# EAGLE design TIEVOX Power (EAGLE 7.4.0)
Power Notes For IC_PWR_1 to work the way we want it to, meaning supplying power from the car, a value of 2.2K - 6K will work just fine for R1. That gives a turn on voltage of 5.5VDC to ~10VDC. Backpower Protection All power inputs are poly fused and have a backpower diode circuit for protecting the RPi.
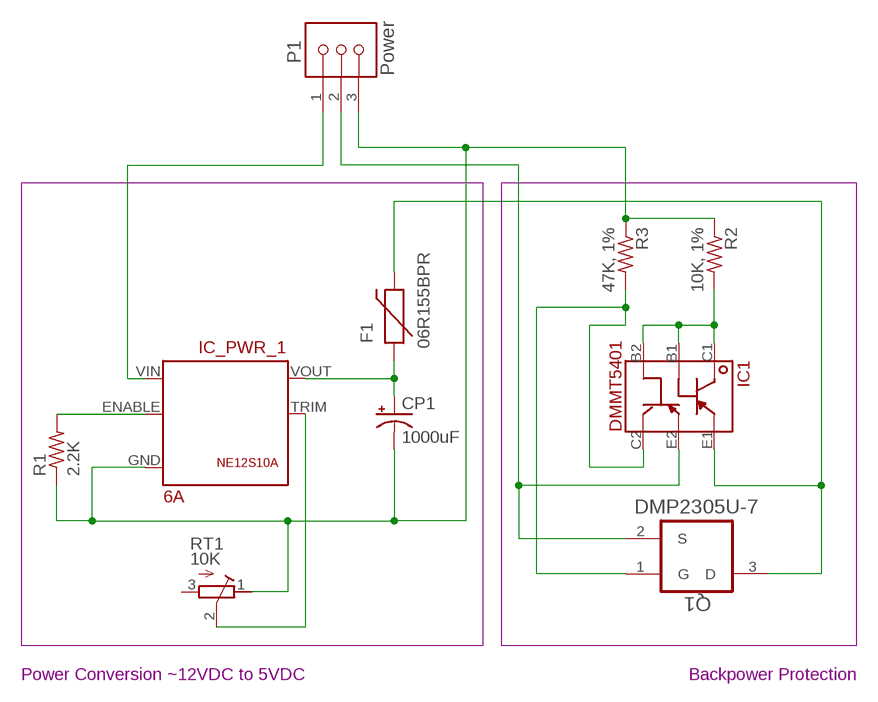
[diagram p0: schematic, sheet 1]

## Parts
CP1  1000uF  CPOL-USE3.5-8  [E3,5-8]
F1  06R155BPR  PTCPTH  [PTC]
IC1  DMMT5401  DMMT5401DMMT  [DMMT5401]
IC_PWR_1  6A  NE12S12V6A  [NE12S]
P1  Power  CONN3-L  [PINHEAD-LOCK-3]
Q1  DMP2305U-7  [SOT103P240X110-3N]
R1  2.2K  R-US_0207/10  [0207/10]
R2  10K, 1%  R-US_0207/7  [0207/7]
R3  47K, 1%  R-US_0207/7  [0207/7]
RT1  10K  R-TRIMM3006P  [RTRIM3006P]

## Nets
+5VDC: IC1.E2 P1.2 Q1.2(S)
GND: IC1.C2 Q1.1(G) R3.2
GND_PC: CP1.- IC_PWR_1.GND P1.3 R1.1 R2.1 R3.1 RT1.1(E)
IN: F1.P$2 IC1.E1 Q1.3(D)
N$16: IC_PWR_1.VIN P1.1
N$28: CP1.+ F1.P$1 IC_PWR_1.VOUT
N$29: IC_PWR_1.ENABLE R1.2
N$32: IC1.B1 IC1.B2 IC1.C1 R2.2
PWR12_TRIM: IC_PWR_1.TRIM RT1.2(S)
Unconnected: RT1.3(A)

## Notes on the sheet
- Power Conversion ~12VDC to 5VDC | Backpower Protection

## Library data of the parts
CP1 = rcl:CPOL-US: POLARIZED CAPACITOR, American symbol
F1 = SparkFun-PowerIC:PTC: Resettable Fuse PTC Resettable Fuse. Spark Fun Electronics SKU : COM-08357
IC1 = Diodes_Inc_By_element14_Batch_1:DMMT5401
IC_PWR_1 = packages:NE12S*
P1 = connector:CONN3-L: 3 pin connector, unspecified; DESC: Header, 3 pin locking; MANUF: Molex; PARTNUM: 22-23-2031; SUPPLIER: Mouser:538-22-23-2031; VALSTAT: label
Q1 = Diodes_Inc_By_element14_Batch_1:DMP2305U-7: P-CHANNEL ENHANCEMENT MODE MOSFET; MPN: DMP2305U-7; OC_FARNELL: 1858668; OC_NEWARK: 23T5607; PACKAGE: SOT-23-3; SUPPLIER: DIODES INC.
R1-R3 = adafruit:R-US_: RESISTOR, American symbol
RT1 = resistor:R-TRIMM: Trimm resistor

## Board
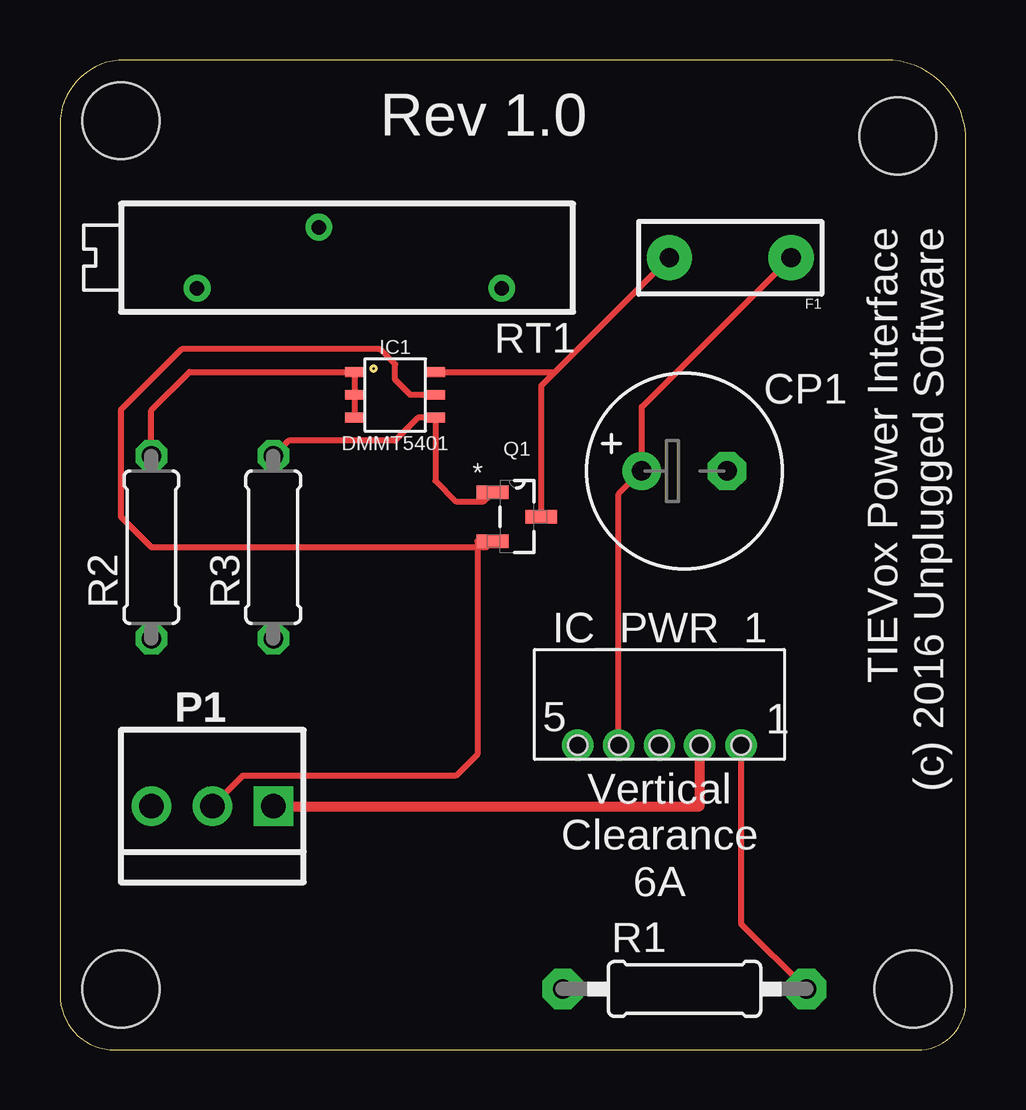
[diagram p1: board, top side]
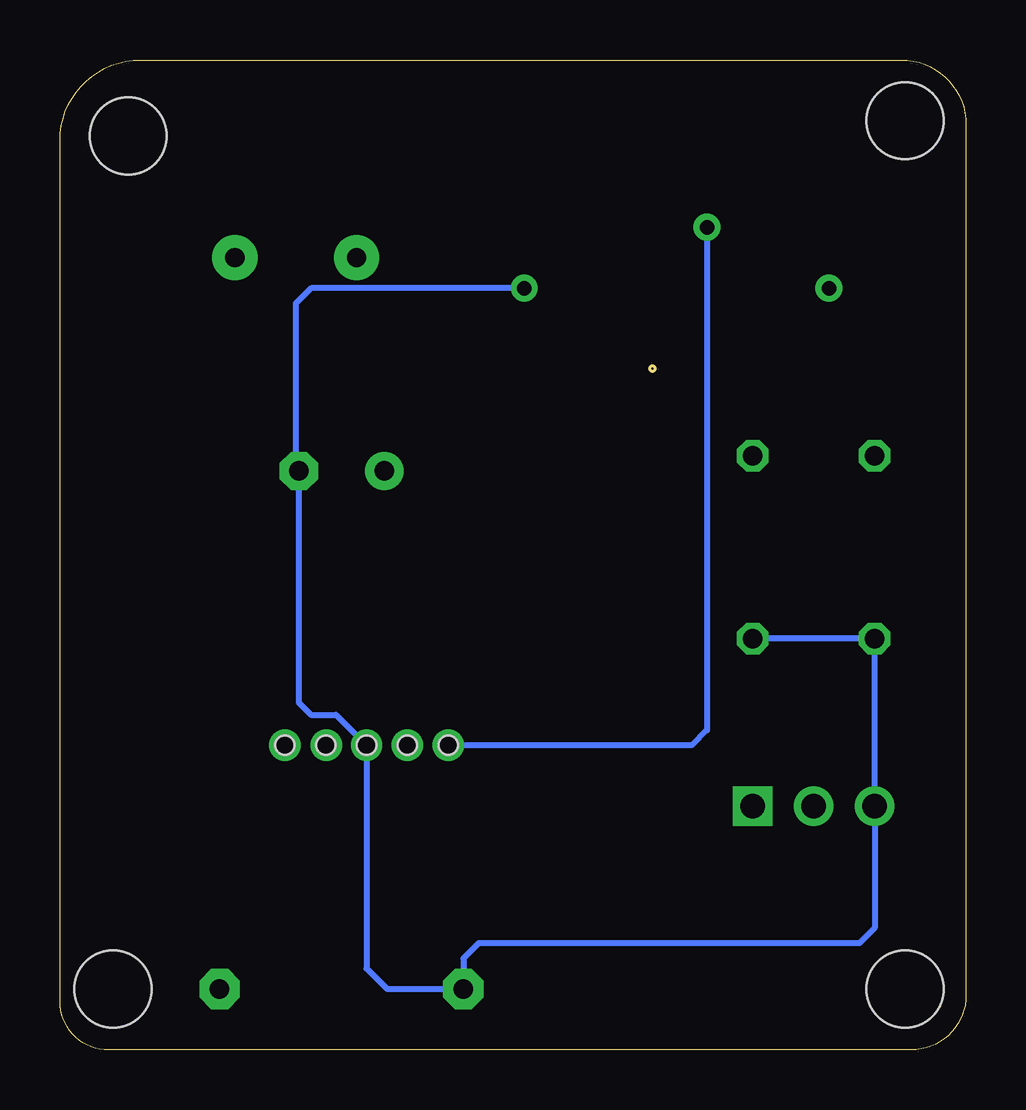
[diagram p2: board, bottom side, seen from below]

Size 37.77 x 41.27 mm. Coordinates in mm from the lower left corner, seen from the top.
Outline: 0,38.58 0,2.29 arc90 2.29,0 35.75,0 arc90 37.77,2.02 37.77,37.91 arc90 34.41,41.27 2.69,41.27 arc90 0,38.58
Copper layers (1*16): Top 0.035mm / dielectric 1.5mm / Bottom 0.035mm
Design rules "default": minimum track width 10mil, minimum drill 24mil, track to track 8mil, track to pad 8mil, pad to pad 8mil, via to via 8mil, smd to smd 8mil, copper to edge 40mil, drill to drill 8mil, minimum pad ring 10mil, minimum via ring 8mil, stop-mask expansion 4mil, vias tented up to drill 0mil, thermal gap 10mil
Holes 3.2 mm at 2.54,2.54 2.54,38.73 34.92,38.1 35.56,2.54

### Footprints (pad centres in the part's own frame; a part is rotated, then mirrored left to right if it is on the bottom)
E3,5-8 = drill 0.813 pad 1.6: + -1.778,0 | drill 0.813 pad 1.6 octagon: - 1.778,0
PTC = drill 0.8 pad 1.88: P$1 -2.54,0; P$2 2.54,0
DMMT5401 = smd 0.406 x 0.813: B1 0,-1.676; B2 0.95,-1.676; C1 -0.95,-1.676; C2 0.95,1.676; E1 -0.95,1.676; E2 0,1.676
NE12S = drill 0.8: ENABLE 6.8,0; GND 3.4,0; TRIM 0,0; VIN 5.08,0; VOUT 1.7,0 | hole 0.8: 1.7,0; 3.4,0; 5.1,0; 6.8,0; 0,0
PINHEAD-LOCK-3 = drill 1.016 pad 1.651 square: 1 2.54,0 | drill 1.016 pad 1.651: 2 0,0; 3 -2.54,0
SOT103P240X110-3N = smd 1.321 x 0.559: 1 -1.016,1.016; 2 -1.016,-1.016; 3 1.016,0
0207/10 = drill 0.813 pad 1.676 octagon: 1 -5.08,0; 2 5.08,0
0207/7 = drill 0.813 octagon: 1 -3.81,0; 2 3.81,0
RTRIM3006P = drill 0.61: 1 -7.62,1.27; 2 0,-1.27; 3 5.08,1.27

### Placement (x,y rotation side)
CP1  26.04,24.13 0 top
F1  27.94,33.02 180 top
IC1  13.97,27.3 270 top
IC_PWR_1  21.59,12.7 0 top
P1  6.35,10.16 0 top
Q1  19.05,22.23 0 top
R1  26.04,2.54 0 top
R2  3.81,20.95 90 top
R3  8.89,20.95 90 top
RT1  10.79,33.02 180 top

### Tracks (layer width: path | path; a pad name or v marks a point on that pad's centre or on a via)
+5VDC
  Top 0.254: IC1.E2 14.61,27.3 13.97,27.94 13.97,28.57 13.34,29.21 5.08,29.21 2.54,26.67 2.54,22.23 3.81,20.95 17.78,20.95 Q1.2 17.4,21.21 17.4,12.32 16.51,11.43 7.62,11.43 P1.2
GND
  Top 0.254: Q1.1 17.65,22.86 16.51,22.86 15.65,23.72 IC1.C2 14.93,26.36 13.97,25.4 9.53,25.4 R3.2
GND_PC
  Bottom 0.254: RT1.1 27.3,31.75 27.94,31.11 27.94,24.26 CP1.- 27.81,14.48 27.3,13.97 26.26,13.97 IC_PWR_1.GND 24.99,3.4 24.13,2.54 R1.1 20.95,3.81 20.32,4.45 4.45,4.45 3.81,5.08 P1.3 R2.1 R3.1
IN
  Top 0.254: IC1.E1 20.64,28.25 | 20.64,28.25 F1.P$2 | Q1.3 20.07,27.69 20.64,28.25
N$16
  Top 0.406: P1.1 26.67,10.16 IC_PWR_1.VIN
N$28
  Top 0.254: IC_PWR_1.VOUT 23.29,23.16 CP1.+ 24.26,26.8 F1.P$1
N$29
  Top 0.254: IC_PWR_1.ENABLE 28.39,5.26 R1.2
N$32
  Top 0.254: IC1.B2 IC1.B1 IC1.C1 5.4,28.26 3.81,26.67 R2.2
PWR12_TRIM
  Bottom 0.254: RT1.2 10.79,13.34 11.43,12.7 IC_PWR_1.TRIM

### Text on the board
tNames: Rev 1.0 | TIEVox Power Interface / (c) 2016 Unplugged Software